# EAGLE design DSPIC33_Board_2020_09_23_A (EAGLE 9.6.1)
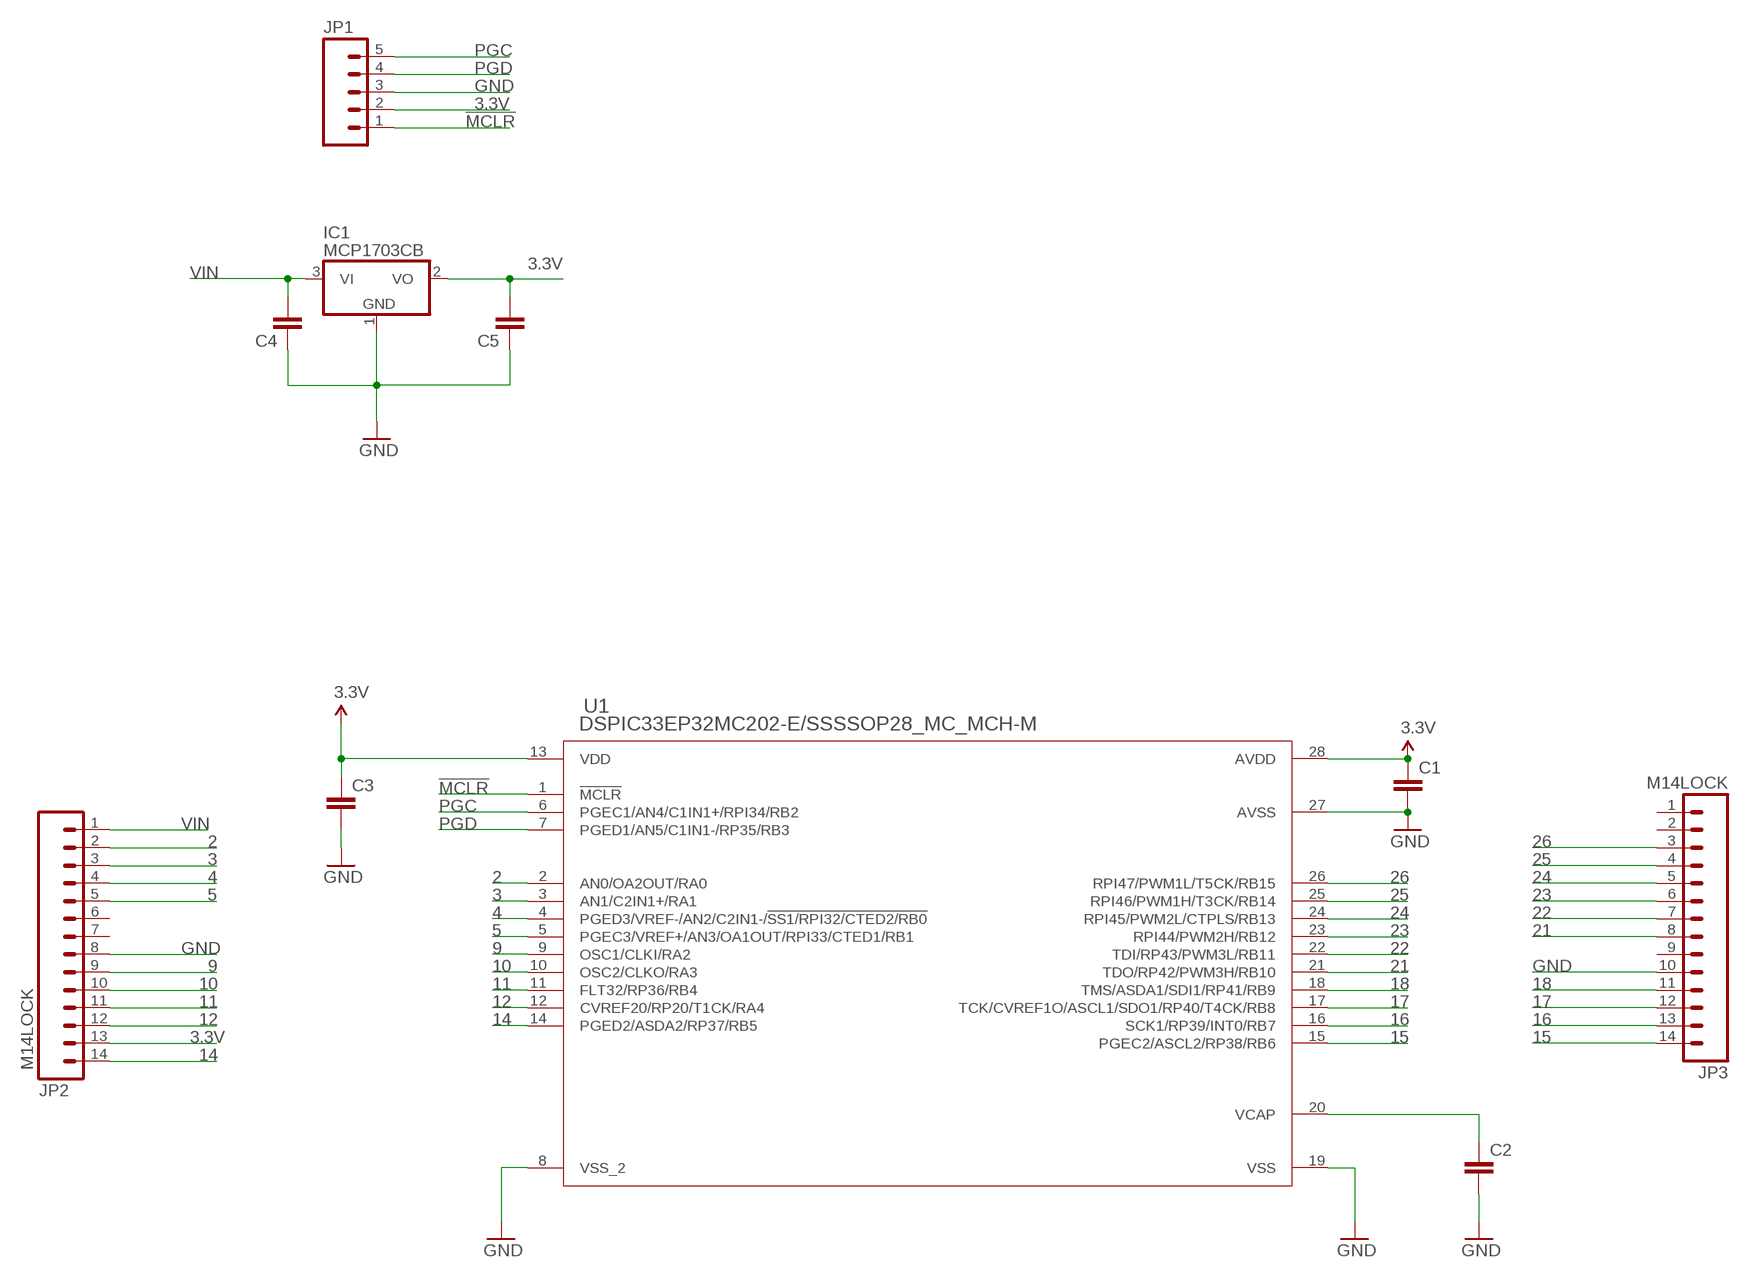
[diagram p0: schematic, sheet 1]

## Parts
C1  CAP1206  [1206]
C2  CAP1206  [1206]
C3  CAP1206  [1206]
C4  CAP1206  [1206]
C5  CAP1206  [1206]
IC1  MCP1703CB  [SOT23]
JP1  M05LOCK  [1X05_LOCK]
JP2  M14LOCK  [1X14_LOCK]
JP3  M14LOCK  [1X14_LOCK]
U1  DSPIC33EP32MC202-E/SSSSOP28_MC_MCH-M  [SSOP28_MC_MCH-M]

## Nets
2: JP2.2 U1.2(AN0/OA2OUT/RA0)
3: JP2.3 U1.3(AN1/C2IN1+/RA1)
3.3V: C1.1 C3.1 C5.2 IC1.2(VO) JP1.2 JP2.13 U1.13(VDD) U1.28(AVDD)
4: JP2.4 U1.4(PGED3/VREF-/AN2/C2IN1-/!SS1/RPI32/CTED2/RB0)
5: JP2.5 U1.5(PGEC3/VREF+/AN3/OA1OUT/RPI33/CTED1/RB1)
9: JP2.9 U1.9(OSC1/CLKI/RA2)
10: JP2.10 U1.10(OSC2/CLKO/RA3)
11: JP2.11 U1.11(FLT32/RP36/RB4)
12: JP2.12 U1.12(CVREF20/RP20/T1CK/RA4)
14: JP2.14 U1.14(PGED2/ASDA2/RP37/RB5)
15: JP3.14 U1.15(PGEC2/ASCL2/RP38/RB6)
16: JP3.13 U1.16(SCK1/RP39/INT0/RB7)
17: JP3.12 U1.17(TCK/CVREF1O/ASCL1/SDO1/RP40/T4CK/RB8)
18: JP3.11 U1.18(TMS/ASDA1/SDI1/RP41/RB9)
21: JP3.8 U1.21(TDO/RP42/PWM3H/RB10)
22: JP3.7 U1.22(TDI/RP43/PWM3L/RB11)
23: JP3.6 U1.23(RPI44/PWM2H/RB12)
24: JP3.5 U1.24(RPI45/PWM2L/CTPLS/RB13)
25: JP3.4 U1.25(RPI46/PWM1H/T3CK/RB14)
26: JP3.3 U1.26(RPI47/PWM1L/T5CK/RB15)
!MCLR: JP1.1 U1.1(!MCLR)
GND: C1.2 C2.1 C3.2 C4.1 C5.1 IC1.1(GND) JP1.3 JP2.8 JP3.10 U1.8(VSS_2) U1.19(VSS) U1.27(AVSS)
N$1: C2.2 U1.20(VCAP)
PGC: JP1.5 U1.6(PGEC1/AN4/C1IN1+/RPI34/RB2)
PGD: JP1.4 U1.7(PGED1/AN5/C1IN1-/RP35/RB3)
VIN: C4.2 IC1.3(VI) JP2.1
Unconnected: JP2.6 JP2.7 JP3.1 JP3.2 JP3.9

## Library data of the parts
C1-C5 = SparkFun-Passives:CAP: Capacitor Standard 0603 ceramic capacitor, and 0.1" leaded capacitor.
IC1 = linear:MCP1703: 250 mA, 16V, Low Quiescent Current LDO Regulator Source: http://ww1.microchip.com/downloads/en/DeviceDoc/22049b.pdf
JP1 = SparkFun-Connectors:M05: Header 5 Standard 5-pin 0.1" header. Use with straight break away headers (SKU : PRT-00116), right angle break away headers (PRT-00553), swiss pins (PRT-00743), machine pins (PRT-00117), and female headers (PRT-00115). Molex polarized connector foot print use with SKU : PRT-08230 with associated crimp pins and housings.
JP2 JP3 = SparkFun-Connectors:M14: Header 14 Standard 14-pin 0.1" header. Use with straight break away headers (SKU : PRT-00116), right angle break away headers (PRT-00553), swiss pins (PRT-00743), machine pins (PRT-00117), and female headers (PRT-00115).
U1 = DSPIC33EP32MC202:DSPIC33EP32MC202-E/SS; BUILT_BY: EMA_Jessica; COPYRIGHT: Copyright (C) 2018 Accelerated Designs. All rights reserved; MANUFACTURER_PART_NUMBER: DSPIC33EP32MC202-E/SS; SOURCELIBRARY: Microchip_2019-08-23_20; VENDOR: Microchip

## Board
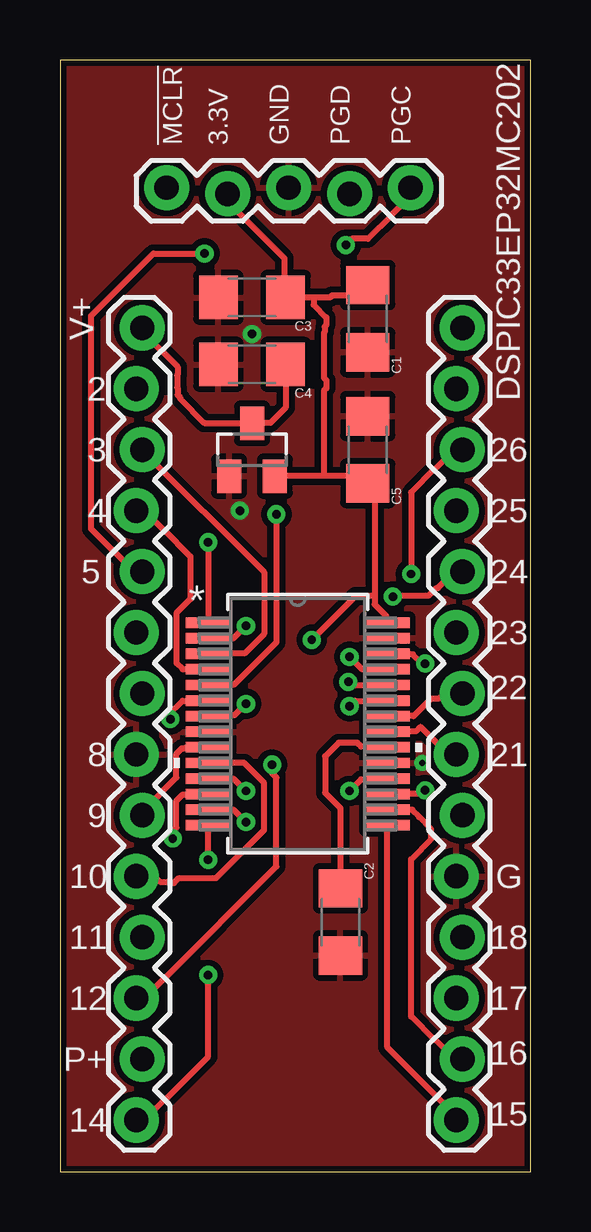
[diagram p1: board, top side]
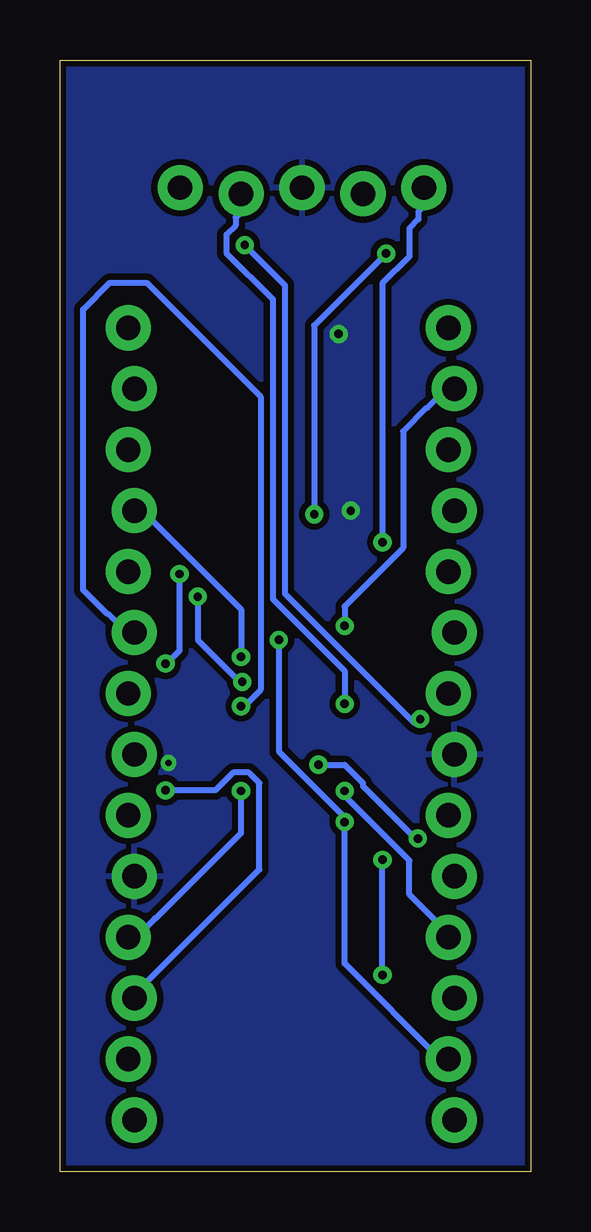
[diagram p2: board, bottom side, seen from below]

Size 19.61 x 46.35 mm. Coordinates in mm from the lower left corner, seen from the top.
Outline: 0,0 19.61,0 19.61,46.35 0,46.35 0,0
Copper layers (1*16): Top 0.035mm / dielectric 1.5mm / Bottom 0.035mm
Design rules "default": minimum track width 10mil, minimum drill 0.35mm, track to track 10mil, track to pad 10mil, pad to pad 10mil, via to via 10mil, smd to smd 6mil, copper to edge 10mil, drill to drill 6mil, minimum pad ring 10mil, minimum via ring 8mil, stop-mask expansion 4mil, vias tented up to drill 0mil, thermal gap 10mil

### Footprints (pad centres in the part's own frame; a part is rotated, then mirrored left to right if it is on the bottom)
1206 = smd 1.6 x 1.8: 1 -1.4,0; 2 1.4,0
SOT23 = smd 1 x 1.4: 1 -0.95,-1.1; 2 0.95,-1.1; 3 0,1.1
1X05_LOCK = drill 1.016 pad 1.88: 1 0,0.127; 2 2.54,-0.127; 3 5.08,0.127; 4 7.62,-0.127; 5 10.16,0.127
1X14_LOCK = drill 1.016 pad 1.88: 1 0,0.127; 2 2.54,-0.127; 3 5.08,0.127; 4 7.62,-0.127; 5 10.16,0.127; 6 12.7,-0.127; 7 15.24,0.127; 8 17.78,-0.127; 9 20.32,0.127; 10 22.86,-0.127; 11 25.4,0.127; 12 27.94,-0.127; 13 30.48,0.127; 14 33.02,-0.127
SSOP28_MC_MCH-M = smd 1.867 x 0.432: 1 -3.727,4.225; 2 -3.727,3.575; 3 -3.727,2.925; 4 -3.727,2.275; 5 -3.727,1.625; 6 -3.727,0.975; 7 -3.727,0.325; 8 -3.727,-0.325; 9 -3.727,-0.975; 10 -3.727,-1.625; 11 -3.727,-2.275; 12 -3.727,-2.925; 13 -3.727,-3.575; 14 -3.727,-4.225; 15 3.727,-4.225; 16 3.727,-3.575; 17 3.727,-2.925; 18 3.727,-2.275; 19 3.727,-1.625; 20 3.727,-0.975; 21 3.727,-0.325; 22 3.727,0.325; 23 3.727,0.975; 24 3.727,1.625; 25 3.727,2.275; 26 3.727,2.925; 27 3.727,3.575; 28 3.727,4.225

### Placement (x,y rotation side)
C1  12.83,35.56 270 top
C2  11.68,10.41 90 top
C3  8,36.45 180 top
C4  8,33.66 0 top
C5  12.83,30.1 270 top
IC1  8,30.1 0 top
JP1  4.45,40.89 0 top
JP2  3.3,35.18 270 top
JP3  16.64,35.18 270 top
U1  9.91,18.67 0 top

### Tracks (layer width: path | path; a pad name or v marks a point on that pad's centre or on a via)
2  (via drill 0.35)
  Top 0.254: v7.75,22.76 7.24,22.25 6.2,22.25 U1.2
  Bottom 0.254: v7.75,22.76 7.75,23.57 5.31,26.01 5.31,30.86 4.32,31.85 4.29,31.85 3.5,32.64 JP2.2
3
  Top 0.254: JP2.3 3.43,30.07 8.51,24.99 8.51,22.43 7.7,21.61 6.2,21.61 U1.3
3.3V  (via drill 0.35)
  Top 0.254: v7.75,14.58 7.24,15.09 6.2,15.09 U1.13 | 11,29.01 12.52,29.01 C5.2 12.88,28.57 13.11,28.35 13.11,24 | 11,29.01 8.97,29.01 IC1.2 | 13.11,24 13.11,23.65 13.61,23.14 13.61,22.91 U1.28 | 10.57,36.45 11.25,36.45 11.33,36.53 12.39,36.53 C1.1 | 10.57,36.45 C3.1 9.35,36.55 9.35,38.08 6.98,40.44 JP1.2 | 11,29.01 11,32.56 11.1,32.66 11.1,33 11,33.1 11,34.98 11.02,35 11.02,35.23 11.1,35.31 11.1,35.61 10.57,36.14 10.57,36.45 | v10.49,22.17 12.32,24 13.11,24
  Bottom 0.254: JP2.13 3.76,4.7 7.75,8.69 v7.75,14.58 7.82,14.68 7.82,14.86 10.49,17.53 v10.49,22.17
4
  Top 0.254: JP2.4 3.5,27.56 4.29,26.77 4.32,26.77 5.44,25.65 5.44,23.88 4.85,23.29 4.85,21.21 5.11,20.95 6.17,20.95 U1.4
5  (via drill 0.35)
  Top 0.254: v9.02,27.41 9.02,22.07 7.24,20.29 6.2,20.29 U1.5 | v6.02,38.28 3.89,38.28 1.3,35.69 1.3,26.8 2.29,25.81 2.31,25.81 3.1,25.02 JP2.5
  Bottom 0.254: v9.02,27.41 9.02,35.28 v6.02,38.28
9
  Top 0.254: JP2.9 3.43,15.01 4.85,16.43 4.85,17.42 5.08,17.65 5.18,17.65 5.21,17.68 U1.9
10
  Top 0.254: JP2.10 3.94,12.32 4.17,12.09 4.5,12.09 4.55,12.04 4.75,12.04 4.95,12.24 6.5,12.24 8.51,14.25 8.51,16.21 7.67,17.04 6.2,17.04 U1.10
11  (via drill 0.35)
  Top 0.254: v7.75,15.88 7.24,16.38 6.2,16.38 U1.11
  Bottom 0.254: v7.75,15.88 7.75,15.67 5.05,12.98 5.05,11.56 3.43,9.93 JP2.11
12  (via drill 0.35)
  Top 0.254: v4.7,13.89 4.7,14.2 4.85,14.35 4.85,15.47 5.11,15.72 6.17,15.72 U1.12 | v8.84,16.97 8.84,16.61 9.02,16.43 9.02,12.72 4.32,8.03 4.29,8.03 3.5,7.24 JP2.12
  Bottom 0.254: v4.7,13.89 4.8,13.89 6.98,16.08 6.98,16.21 7.75,16.97 v8.84,16.97
14  (via drill 0.35)
  Top 0.254: v6.17,13 6.17,14.43 U1.14 | v6.17,8.2 6.17,4.8 4.32,2.95 4.29,2.95 3.5,2.16 JP2.14
  Bottom 0.254: v6.17,8.2 v6.17,13
15
  Top 0.254: JP3.14 16.51,2.31 13.64,5.18 13.64,14.43 U1.15
16
  Top 0.254: JP3.13 16.43,4.7 15.65,5.49 15.62,5.49 14.63,6.48 14.63,13.03 15.47,13.87 15.47,14.27 14.96,14.78 14.96,14.81 14.68,15.09 U1.16
17  (via drill 0.35)
  Top 0.254: v15.21,15.9 15.06,15.75 U1.17
  Bottom 0.254: v15.21,15.9 13.13,15.9 12.39,16.64 11.73,16.64 11.3,16.21 11.3,12.6 16.51,7.39 JP3.12
18  (via drill 0.35)
  Top 0.254: v12.07,15.88 12.55,16.36 12.68,16.36 12.7,16.38 13.61,16.38 U1.18
  Bottom 0.254: v12.07,15.88 12.07,14.12 15.62,10.57 15.65,10.57 16.43,9.78 JP3.11
21
  Top 0.254: JP3.8 16.18,17.4 15.04,18.54 15.01,18.54 14.83,18.36 13.64,18.36 U1.21
22
  Top 0.254: JP3.7 16,19.94 15.77,19.71 15.44,19.71 14.73,19 U1.22
23  (via drill 0.35)
  Top 0.254: v12.07,19.41 12.29,19.63 13.61,19.63 U1.23
  Bottom 0.254: v12.07,19.41 11.94,19.41 11.25,20.09 11.25,32.31 16,37.06 17.53,37.06 18.64,35.94 18.64,24.26 17.65,23.27 17.63,23.27 16.84,22.48 JP3.6
24  (via drill 0.35)
  Top 0.254: v12.01,20.42 12.14,20.29 13.61,20.29 U1.24 | v13.87,23.98 13.89,24 15.34,24 15.67,24.33 15.75,24.33 16.43,25.02 JP3.5
  Bottom 0.254: v12.01,20.42 12.12,20.42 13.87,22.17 v13.87,23.98
25  (via drill 0.35)
  Top 0.254: v12.07,21.46 12.57,20.95 13.61,20.95 U1.25
  Bottom 0.254: v12.07,21.46 12.07,23.44 16.18,27.56 JP3.4
26  (via drill 0.35)
  Top 0.254: v15.21,21.18 15.09,21.18 14.71,21.56 14.58,21.56 14.55,21.59 U1.26 | v14.63,24.92 14.63,28.32 15.62,29.31 15.65,29.31 16.43,30.1 JP3.3
  Bottom 0.254: v15.21,21.18 15.16,21.18 14.63,21.72 v14.63,24.92
!MCLR  (via drill 0.35)
  Top 0.254: v6.17,26.24 6.17,22.91 U1.1
  Bottom 0.254: v6.17,26.24 6.17,37.03 5.05,38.15 5.05,39.32 4.67,39.7 4.67,40.03 4.45,40.26 JP1.1
GND  (via drill 0.25, 0.35)
  other vias: 7.49,27.56 8,34.93 15.09,17.04
  pour Top (isolate 0.254): -1.4,46.86 21.21,46.86 21.21,0.13 20.45,-0.64 -0.89,-0.64 -1.65,0.13 -1.65,46.61
  pour Bottom (isolate 0.254): -1.4,48.64 22.23,48.64 24.51,46.36 24.51,-0.13 16.64,-8 4.7,-8 -5.97,2.67 -5.97,44.07
N$1
  Top 0.254: C2.2 11.68,15.16 11.05,15.8 11.05,17.32 11.61,17.88 12.39,17.88 12.55,17.73 13.59,17.73 13.61,17.7 U1.20
PGC  (via drill 0.35)
  Top 0.254: v4.6,18.87 4.5,18.97 4.5,19.02 5.11,19.63 6.17,19.63 U1.6 | v11.91,38.63 12.17,38.89 12.83,38.89 13.82,39.88 13.82,39.9 14.61,40.69 JP1.5
  Bottom 0.254: v4.6,18.87 4.77,18.69 4.83,18.69 10.24,24.11 10.24,36.96 v11.91,38.63
PGD  (via drill 0.35)
  Top 0.254: v7.75,19.51 7.26,19.02 7.14,19.02 7.11,19 6.2,19 U1.7
  Bottom 0.254: v7.75,19.51 7.75,20.88 10.74,23.88 10.74,36.37 12.68,38.3 12.68,39.07 12.29,39.45 12.29,39.78 12.07,40.01 JP1.4
VIN
  Top 0.254: C4.2 9.4,31.85 8.76,31.22 8,31.22 IC1.3 7.9,31.22 6.02,31.22 5,32.23 5,32.28 4.9,32.38 4.9,32.66 4.88,32.69 4.88,33.2 4.9,33.22 4.9,33.55 3.43,35.03 JP2.1

### Text on the board
tPlace: !MCLR | 3.3V | GND | PGD | PGC | V+ | 2 | DSPIC33EP32MC202 | 3 | 26 | 4 | 25 | 5 | 24 | 23 | 22 | 8 | 21 | 9 | 10 | G | 11 | 18 | 12 | 17 | 16 | P+ | 14 | 15